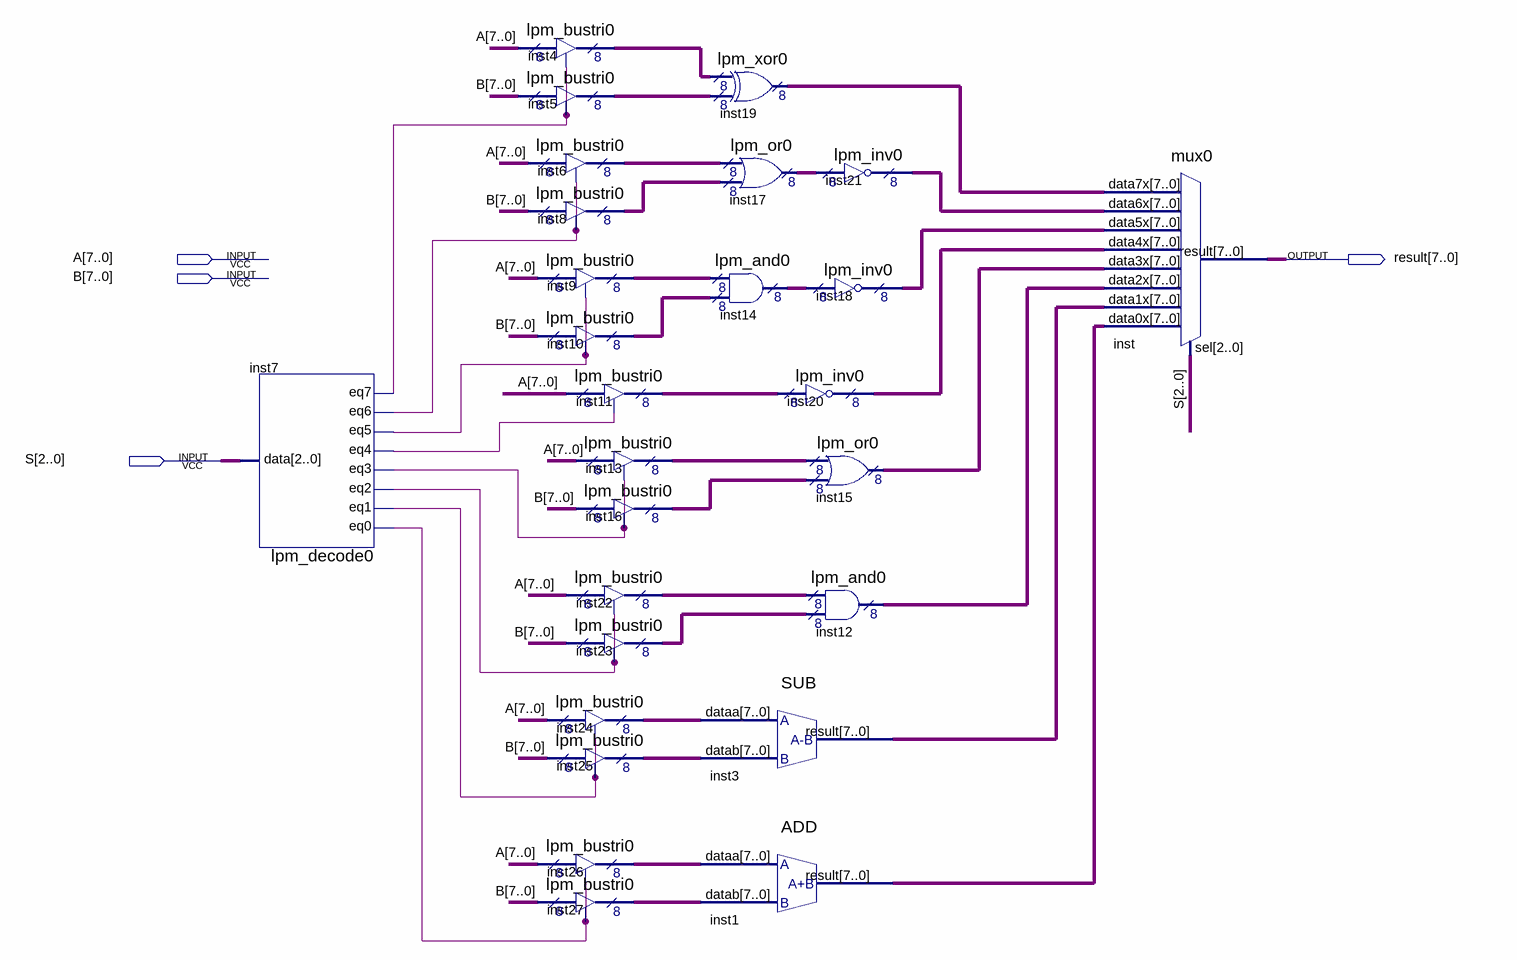
[diagram p0: schematic sheet]
// Quartus schematic 8choose1.bdf as structural Verilog: 27 symbols, 4 pins
module \8choose1  (
  input  [7:0] A,
  input  [7:0] B,
  input  [2:0] S,
  output [7:0] result
);

  wire inst7_eq0, inst7_eq1, inst7_eq2, inst7_eq3, inst7_eq4, inst7_eq5, inst7_eq6, inst7_eq7;
  wire [7:0] inst1_result, inst3_result, inst4_tridata, inst5_tridata, inst6_tridata, inst8_tridata,
       inst9_tridata, inst10_tridata, inst11_tridata, inst12_result, inst13_tridata, inst14_result,
       inst15_result, inst16_tridata, inst17_result, inst18_result, inst19_result, inst20_result,
       inst21_result, inst22_tridata, inst23_tridata, inst24_tridata, inst25_tridata, inst26_tridata,
       inst27_tridata;

  lpm_decode0 inst7 (
    .data(S), .eq0(inst7_eq0), .eq1(inst7_eq1), .eq2(inst7_eq2), .eq3(inst7_eq3), .eq4(inst7_eq4),
    .eq5(inst7_eq5), .eq6(inst7_eq6), .eq7(inst7_eq7));
  lpm_bustri0 inst4 (.enabledt(inst7_eq7), .data(A), .tridata(inst4_tridata));
  lpm_bustri0 inst5 (.enabledt(inst7_eq7), .data(B), .tridata(inst5_tridata));
  lpm_bustri0 inst6 (.enabledt(inst7_eq6), .data(A), .tridata(inst6_tridata));
  lpm_bustri0 inst8 (.enabledt(inst7_eq6), .data(B), .tridata(inst8_tridata));
  lpm_bustri0 inst9 (.enabledt(inst7_eq5), .data(A), .tridata(inst9_tridata));
  lpm_bustri0 inst10 (.enabledt(inst7_eq5), .data(B), .tridata(inst10_tridata));
  lpm_bustri0 inst11 (.enabledt(inst7_eq4), .data(A), .tridata(inst11_tridata));
  lpm_bustri0 inst13 (.enabledt(inst7_eq3), .data(A), .tridata(inst13_tridata));
  lpm_bustri0 inst16 (.enabledt(inst7_eq3), .data(B), .tridata(inst16_tridata));
  lpm_bustri0 inst22 (.enabledt(inst7_eq2), .data(A), .tridata(inst22_tridata));
  lpm_bustri0 inst23 (.enabledt(inst7_eq2), .data(B), .tridata(inst23_tridata));
  lpm_bustri0 inst24 (.enabledt(inst7_eq1), .data(A), .tridata(inst24_tridata));
  lpm_bustri0 inst25 (.enabledt(inst7_eq1), .data(B), .tridata(inst25_tridata));
  lpm_bustri0 inst26 (.enabledt(inst7_eq0), .data(A), .tridata(inst26_tridata));
  lpm_bustri0 inst27 (.enabledt(inst7_eq0), .data(B), .tridata(inst27_tridata));
  lpm_xor0 inst19 (.data0x(inst4_tridata), .data1x(inst5_tridata), .result(inst19_result));
  lpm_or0 inst17 (.data0x(inst6_tridata), .data1x(inst8_tridata), .result(inst17_result));
  lpm_and0 inst14 (.data0x(inst9_tridata), .data1x(inst10_tridata), .result(inst14_result));
  SUB inst3 (.dataa(inst24_tridata), .datab(inst25_tridata), .result(inst3_result));
  ADD inst1 (.dataa(inst26_tridata), .datab(inst27_tridata), .result(inst1_result));
  lpm_inv0 inst21 (.data(inst17_result), .result(inst21_result));
  lpm_inv0 inst18 (.data(inst14_result), .result(inst18_result));
  lpm_inv0 inst20 (.data(inst11_tridata), .result(inst20_result));
  lpm_or0 inst15 (.data0x(inst13_tridata), .data1x(inst16_tridata), .result(inst15_result));
  lpm_and0 inst12 (.data0x(inst22_tridata), .data1x(inst23_tridata), .result(inst12_result));
  mux0 inst (
    .data7x(inst19_result), .data6x(inst21_result), .data5x(inst18_result), .data4x(inst20_result),
    .data3x(inst15_result), .data2x(inst12_result), .data1x(inst3_result), .data0x(inst1_result), .sel(S),
    .result(result));
endmodule
